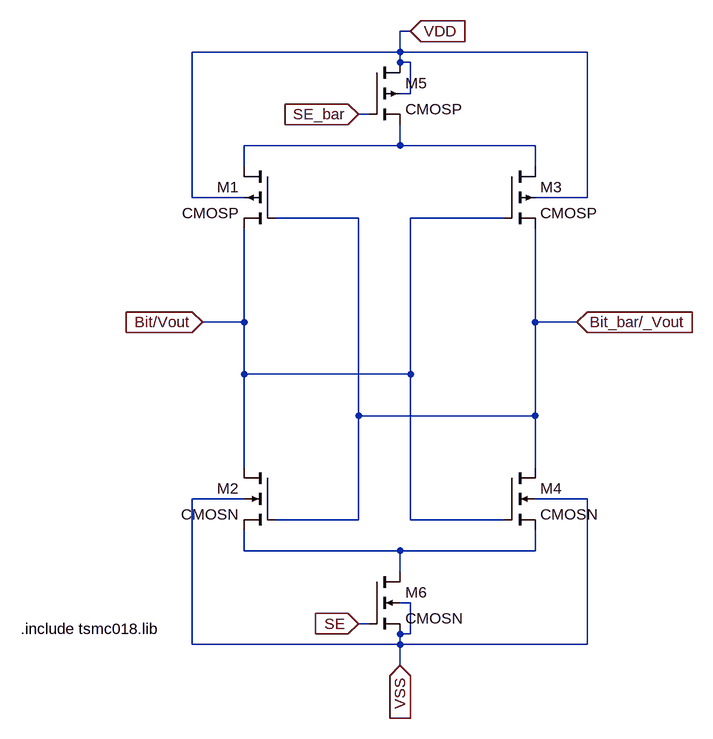
[diagram p0: schematic Sense_Amplifier.asc]
Sense_Amplifier.asc, the LTspice schematic file:
Version 4.1
SHEET 1 880 728
WIRE 288 -416 272 -416
WIRE 272 -384 272 -416
WIRE 272 -384 -48 -384
WIRE 560 -384 272 -384
WIRE 272 -368 272 -384
WIRE 288 -368 272 -368
WIRE 288 -320 288 -368
WIRE 288 -320 272 -320
WIRE 224 -288 208 -288
WIRE 272 -240 272 -272
WIRE 272 -240 32 -240
WIRE 480 -240 272 -240
WIRE 32 -208 32 -240
WIRE 480 -208 480 -240
WIRE -48 -160 -48 -384
WIRE 32 -160 -48 -160
WIRE 560 -160 560 -384
WIRE 560 -160 480 -160
WIRE 208 -128 80 -128
WIRE 432 -128 288 -128
WIRE 32 32 32 -112
WIRE 32 32 -32 32
WIRE 480 32 480 -112
WIRE 544 32 480 32
WIRE 32 112 32 32
WIRE 288 112 288 -128
WIRE 288 112 32 112
WIRE 208 176 208 -128
WIRE 480 176 480 32
WIRE 480 176 208 176
WIRE 32 256 32 112
WIRE 480 256 480 176
WIRE 32 304 -48 304
WIRE 560 304 480 304
WIRE 208 336 208 176
WIRE 208 336 80 336
WIRE 288 336 288 112
WIRE 432 336 288 336
WIRE 32 384 32 352
WIRE 272 384 32 384
WIRE 480 384 480 352
WIRE 480 384 272 384
WIRE 272 416 272 384
WIRE 288 464 272 464
WIRE 224 496 208 496
WIRE 288 512 288 464
WIRE 288 512 272 512
WIRE -48 528 -48 304
WIRE 272 528 272 512
WIRE 272 528 -48 528
WIRE 560 528 560 304
WIRE 560 528 272 528
WIRE 272 560 272 528
FLAG -32 32 Bit/Vout
IOPIN -32 32 In
FLAG 544 32 Bit_bar/_Vout
IOPIN 544 32 In
FLAG 208 -288 SE_bar
IOPIN 208 -288 In
FLAG 288 -416 VDD
IOPIN 288 -416 In
FLAG 208 496 SE
IOPIN 208 496 In
FLAG 272 560 VSS
IOPIN 272 560 In
SYMBOL pmos4 80 -208 M0
SYMATTR InstName M1
SYMATTR Value CMOSP
SYMATTR Value2 l=0.5u w=2u
SYMBOL nmos4 80 256 M0
SYMATTR InstName M2
SYMATTR Value CMOSN
SYMATTR Value2 l=0.5u w=1u
SYMBOL pmos4 432 -208 R0
SYMATTR InstName M3
SYMATTR Value CMOSP
SYMATTR Value2 l=0.5u w=2u
SYMBOL nmos4 432 256 R0
SYMATTR InstName M4
SYMATTR Value CMOSN
SYMATTR Value2 l=0.5u w=1u
SYMBOL pmos4 224 -368 R0
SYMATTR InstName M5
SYMATTR Value CMOSP
SYMATTR Value2 l=0.5u w=1u
SYMBOL nmos4 224 416 R0
SYMATTR InstName M6
SYMATTR Value CMOSN
SYMATTR Value2 l=0.5u w=3u
TEXT -312 504 Left 2 !.include tsmc018.lib

The netlist it stands for:
* Sense_Amplifier.asc
M1 N001 Bit_bar/_Vout Bit/Vout VDD CMOSP l=0.5u w=2u
M2 Bit/Vout Bit_bar/_Vout N002 VSS CMOSN l=0.5u w=1u
M3 N001 Bit/Vout Bit_bar/_Vout VDD CMOSP l=0.5u w=2u
M4 Bit_bar/_Vout Bit/Vout N002 VSS CMOSN l=0.5u w=1u
M5 VDD SE_bar N001 VDD CMOSP l=0.5u w=1u
M6 N002 SE VSS VSS CMOSN l=0.5u w=3u
.model NMOS NMOS
.model PMOS PMOS
.lib standard.mos
.include tsmc018.lib
.backanno
.end